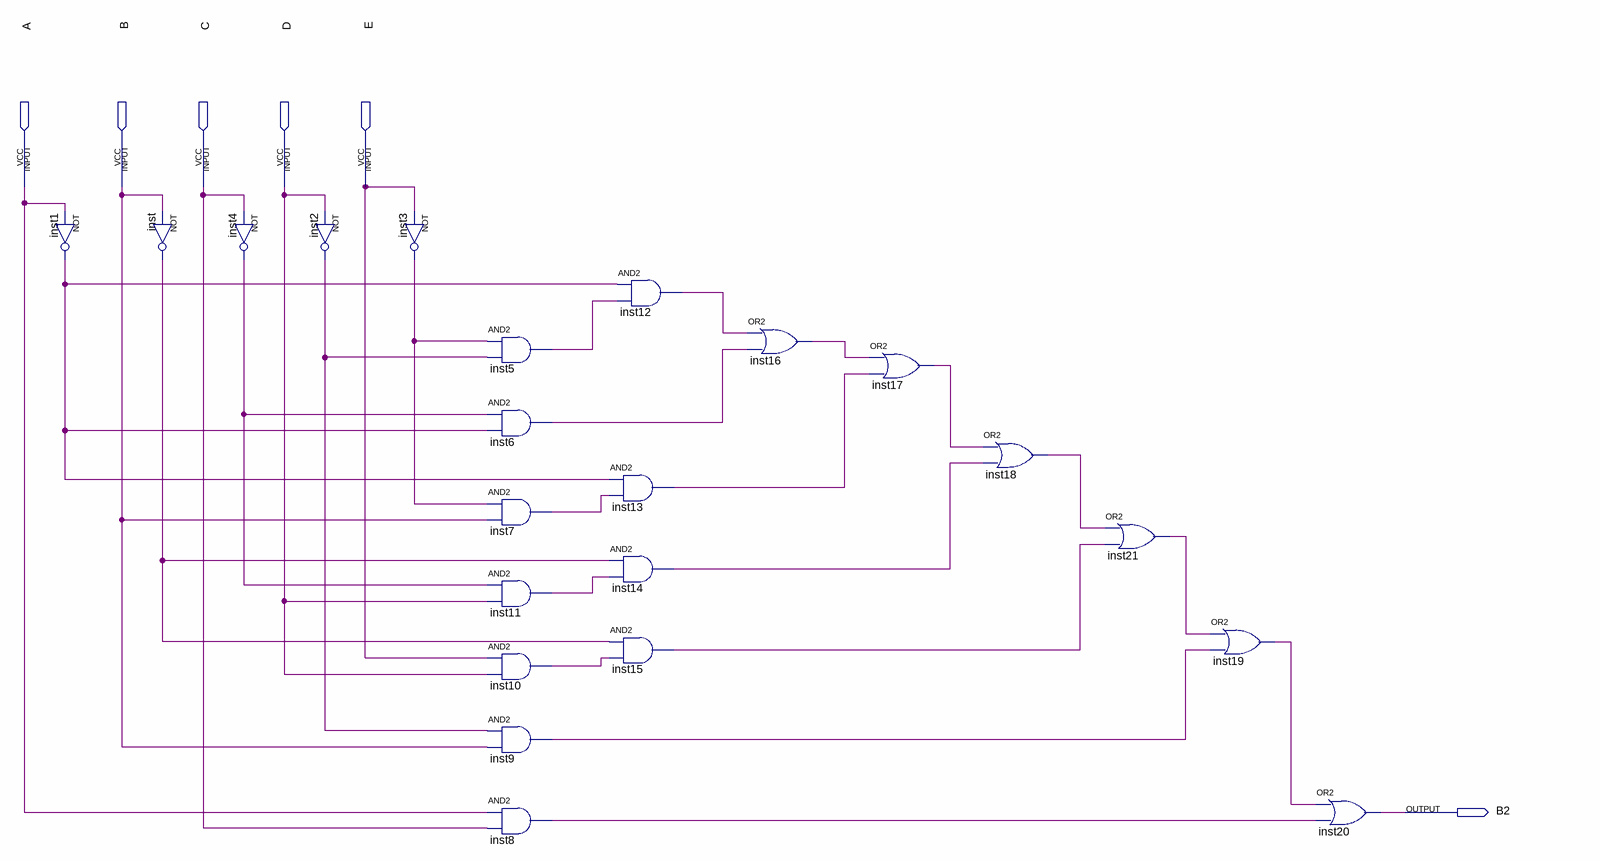
[diagram p0: schematic sheet]
// Quartus schematic led-B2.bdf as structural Verilog: 22 symbols, 6 pins
module \led-B2  (
  input  A,
  input  B,
  input  C,
  input  D,
  input  E,
  output B2
);

  wire inst1_out, inst2_out, inst3_out, inst4_out, inst5_out, inst6_out, inst7_out, inst8_out, inst9_out,
       inst10_out, inst11_out, inst12_out, inst13_out, inst14_out, inst15_out, inst16_out, inst17_out,
       inst18_out, inst19_out, inst21_out, inst_out;

  not inst1 (inst1_out, A);
  not inst (inst_out, B);
  not inst4 (inst4_out, C);
  not inst2 (inst2_out, D);
  not inst3 (inst3_out, E);
  and inst5 (inst5_out, inst3_out, inst2_out);
  and inst6 (inst6_out, inst4_out, inst1_out);
  and inst7 (inst7_out, inst3_out, B);
  and inst11 (inst11_out, inst4_out, D);
  and inst10 (inst10_out, E, D);
  and inst9 (inst9_out, inst2_out, B);
  and inst8 (inst8_out, A, C);
  and inst13 (inst13_out, inst1_out, inst7_out);
  and inst14 (inst14_out, inst_out, inst11_out);
  and inst15 (inst15_out, inst_out, inst10_out);
  and inst12 (inst12_out, inst1_out, inst5_out);
  or inst16 (inst16_out, inst12_out, inst6_out);
  or inst17 (inst17_out, inst16_out, inst13_out);
  or inst18 (inst18_out, inst17_out, inst14_out);
  or inst21 (inst21_out, inst18_out, inst15_out);
  or inst19 (inst19_out, inst21_out, inst9_out);
  or inst20 (B2, inst19_out, inst8_out);
endmodule
